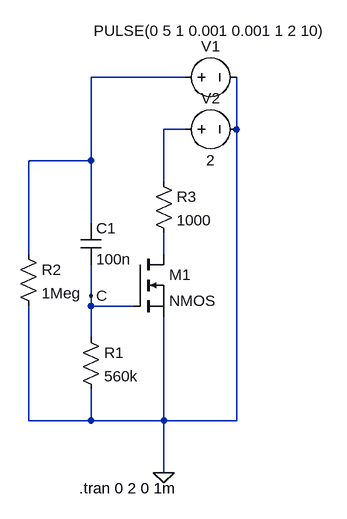
[diagram p0: schematic Mosfet_driver.asc]
Mosfet_driver.asc, the LTspice schematic file:
Version 4
SHEET 1 880 680
WIRE 320 -336 176 -336
WIRE 320 -256 288 -256
WIRE 400 -256 400 -336
WIRE 176 -208 176 -336
WIRE 176 -208 80 -208
WIRE 288 -176 288 -256
WIRE 176 -112 176 -208
WIRE 80 -64 80 -208
WIRE 288 -64 288 -96
WIRE 176 0 176 -48
WIRE 176 16 176 0
WIRE 240 16 176 16
WIRE 176 64 176 16
WIRE 80 192 80 16
WIRE 176 192 176 144
WIRE 176 192 80 192
WIRE 288 192 288 32
WIRE 288 192 176 192
WIRE 400 192 400 -256
WIRE 400 192 288 192
WIRE 288 272 288 192
FLAG 288 272 0
FLAG 176 0 C
SYMBOL nmos 240 -64 R0
SYMATTR InstName M1
SYMBOL res 160 48 R0
SYMATTR InstName R1
SYMATTR Value 560k
SYMBOL cap 160 -112 R0
SYMATTR InstName C1
SYMATTR Value 100n
SYMBOL res 64 -80 R0
SYMATTR InstName R2
SYMATTR Value 1Meg
SYMBOL voltage 304 -336 R270
WINDOW 0 32 56 VTop 2
WINDOW 3 87 55 VBottom 2
WINDOW 123 0 0 Left 0
WINDOW 39 0 0 Left 0
SYMATTR InstName V1
SYMATTR Value PULSE(0 5 1 0.001 0.001 1 2 10)
SYMBOL res 272 -192 R0
SYMATTR InstName R3
SYMATTR Value 1000
SYMBOL voltage 304 -256 R270
WINDOW 0 32 56 VTop 2
WINDOW 3 -32 56 VBottom 2
WINDOW 123 0 0 Left 0
WINDOW 39 0 0 Left 0
SYMATTR InstName V2
SYMATTR Value 2
TEXT 158 296 Left 2 !.tran 0 2 0 1m

The netlist it stands for:
* Mosfet_driver.asc
M1 N003 C 0 0 NMOS
R1 C 0 560k
C1 N001 C 100n
R2 N001 0 1Meg
V1 N001 0 PULSE(0 5 1 0.001 0.001 1 2 10)
R3 N002 N003 1000
V2 N002 0 2
.model NMOS NMOS
.model PMOS PMOS
.lib standard.mos
.tran 0 2 0 1m
.backanno
.end